# EAGLE design host-Insulation (EAGLE 6.6.0)
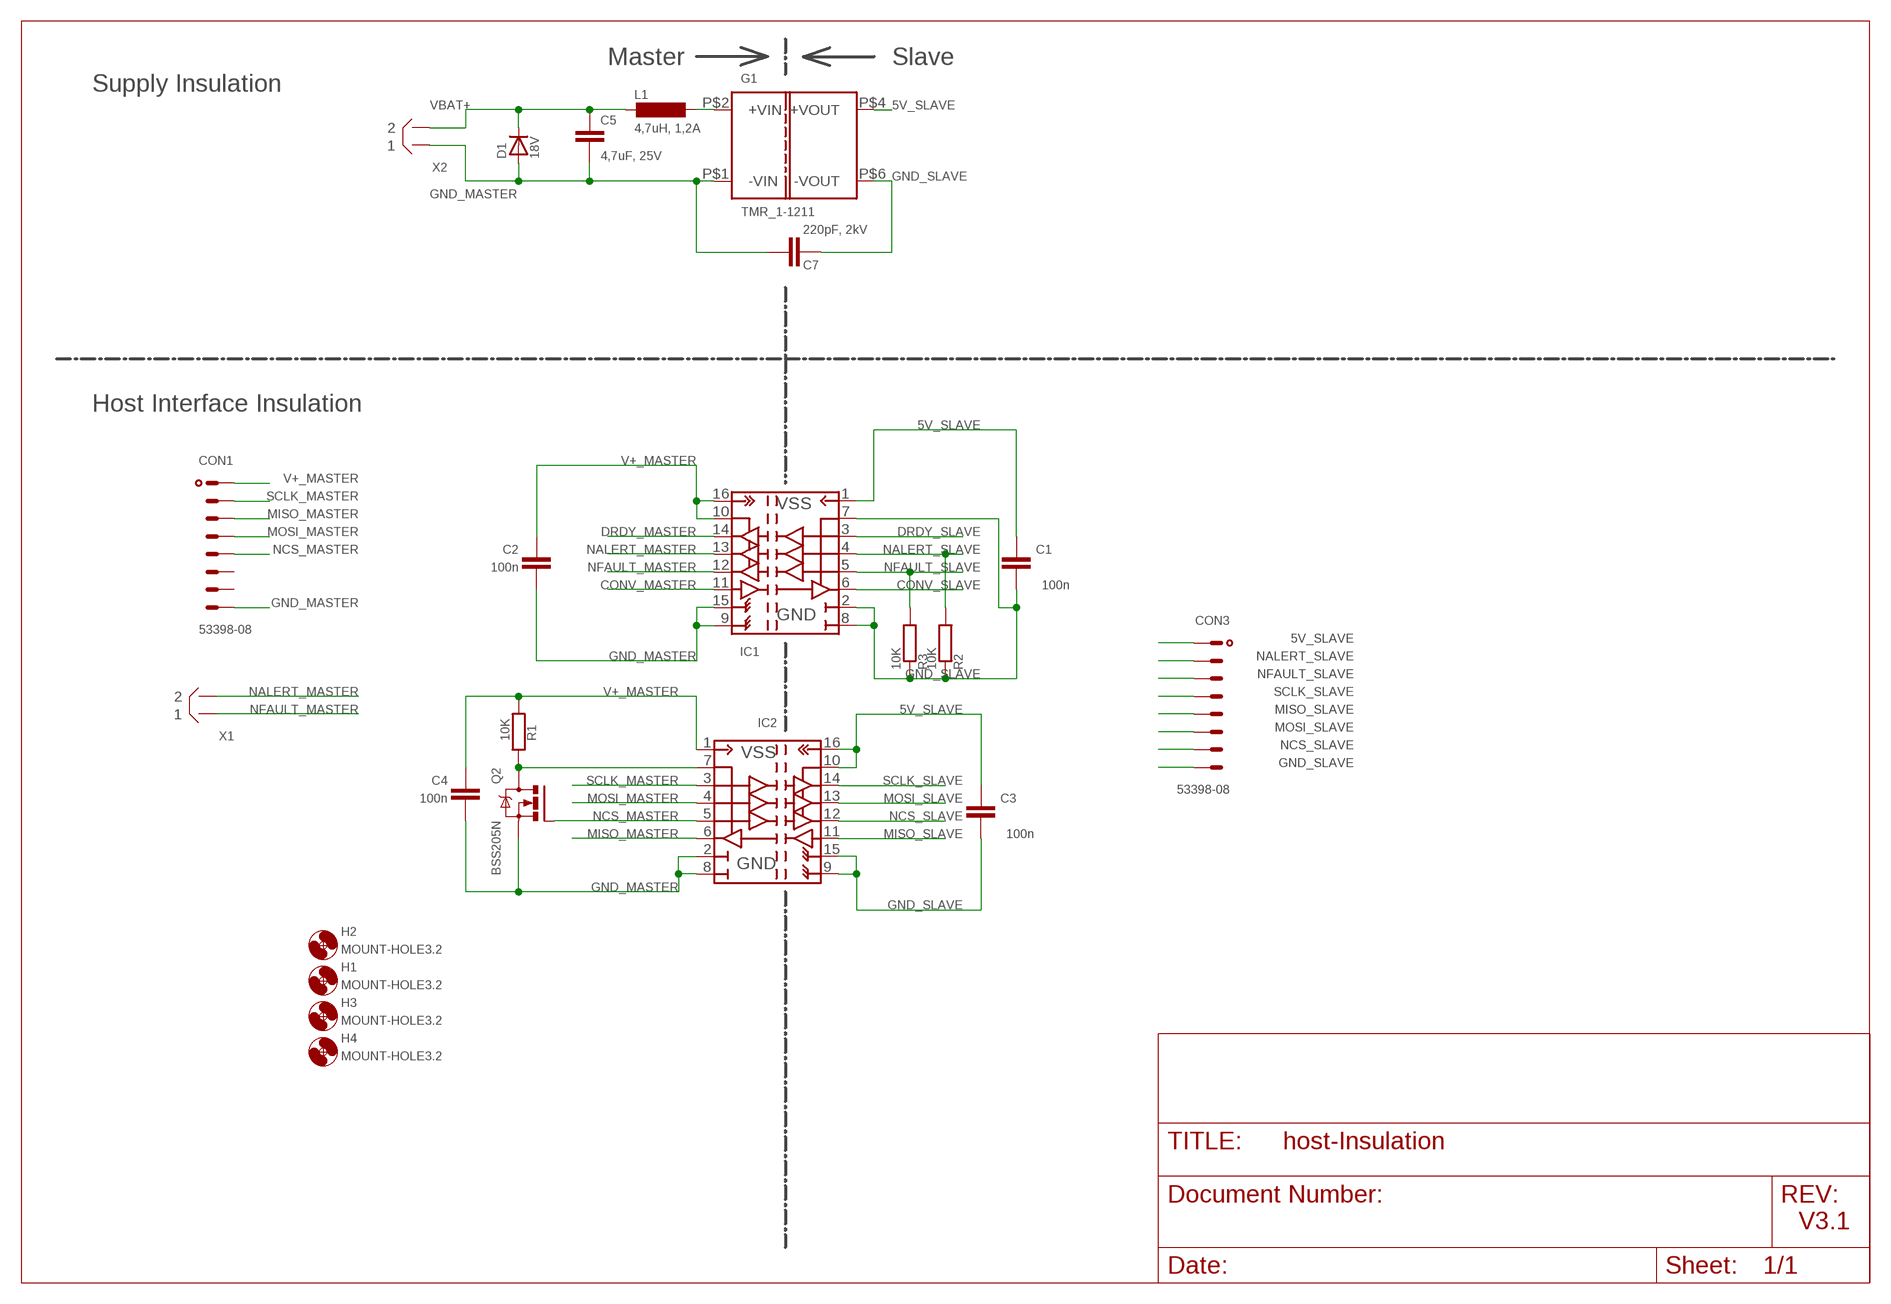
[diagram p0: schematic, sheet 1]

## Parts
C1  100n  CSTD  [C0805]
C2  100n  CSTD  [C0805]
C3  100n  CSTD  [C0805]
C4  100n  CSTD  [C0805]
C5  4,7uF, 25V  C-EUC0805  [C0805]
C7  220pF, 2kV  CC1210_HV  [C1210_HV]
CON1  53398-08  [53398-08]
CON3  53398-08  [53398-08]
D1  18V  DIODE-DO214AA  [DO214AA]
G1  TMR_1-1211  TMR_1-1  [TMR_1-??1?]
H1  MOUNT-HOLE3.2  [3,2]
H2  MOUNT-HOLE3.2  [3,2]
H3  MOUNT-HOLE3.2  [3,2]
H4  MOUNT-HOLE3.2  [3,2]
IC1  ISO7241  [R-PDSO-G16]
IC2  ISO7241  [R-PDSO-G16]
L1  4,7uH, 1,2A  L-EUL3225M  [L3225M]
Q2  BSS205N  [SOT23]
R1  10K  R  [R0805]
R2  10K  R  [R0805]
R3  10K  R  [R0805]
X1  B2B-XH  [B2B-XH]
X2  B2B-XH  [B2B-XH]

## Nets
5V_SLAVE: C1.2 C3.2 CON3.1 G1.P$4(+VOUT) IC1.1(VCC1) IC2.10(EN2) IC2.16(VCC2)
CONV_MASTER: IC1.11(IN_D)
CONV_SLAVE: IC1.6(OUT_D)
DRDY_MASTER: IC1.14(OUT_A)
DRDY_SLAVE: IC1.3(IN_A)
GND_MASTER: C2.1 C4.1 C5.2 C7.P$1 CON1.8 D1.A G1.P$1(-VIN) IC1.9(GND22) IC1.15(GND21) IC2.2(GND11) IC2.8(GND12) Q2.2(S) X2.P$1
GND_SLAVE: C1.1 C3.1 C7.P$2 CON3.8 G1.P$6(-VOUT) IC1.2(GND11) IC1.7(EN1) IC1.8(GND12) IC2.9(GND22) IC2.15(GND21) R2.1 R3.1
MISO_MASTER: CON1.3 IC2.6(OUT_D)
MISO_SLAVE: CON3.5 IC2.11(IN_D)
MOSI_MASTER: CON1.4 IC2.4(IN_B)
MOSI_SLAVE: CON3.6 IC2.13(OUT_B)
N$2: IC2.7(EN1) Q2.3(D) R1.1
N$5: G1.P$2(+VIN) L1.1
NALERT_MASTER: IC1.13(OUT_B) X1.P$2
NALERT_SLAVE: CON3.2 IC1.4(IN_B) R2.2
NCS_MASTER: CON1.5 IC2.5(IN_C) Q2.1(G)
NCS_SLAVE: CON3.7 IC2.12(OUT_C)
NFAULT_MASTER: IC1.12(OUT_C) X1.P$1
NFAULT_SLAVE: CON3.3 IC1.5(IN_C) R3.2
SCLK_MASTER: CON1.2 IC2.3(IN_A)
SCLK_SLAVE: CON3.4 IC2.14(OUT_A)
V+_MASTER: C2.2 C4.2 CON1.1 IC1.10(EN2) IC1.16(VCC2) IC2.1(VCC1) R1.2
VBAT+: C5.1 D1.C L1.2 X2.P$2
Unconnected: CON1.6 CON1.7

## Notes on the sheet
- Master | Slave
- Supply Insulation
- Host Interface Insulation
- V3.1

## Library data of the parts
C1-C4 C7 = useful:C
C5 = rcl:C-EU: CAPACITOR, European symbol
CON1 CON3 = con-molex:53?-08: CONNECTOR wire to board 1.25 mm (.049 inch) pitch header
D1 = diode:DIODE-: DIODE
G1 = traco-power:TMR_1-??1?
H1-H4 = holes:MOUNT-HOLE: MOUNTING HOLE with drill center marker
IC1 IC2 = ti:ISO7241
L1 = rcl:L-EU: INDUCTOR, European symbol
Q2 = infineon:BSS205N: Infineon Small Signal Transistor, OptiMOS 2 Technology, 20V, 2.5A SOT23
R1-R3 = useful:R
X1 X2 = con-jst-xh:?2B-XH

## Board
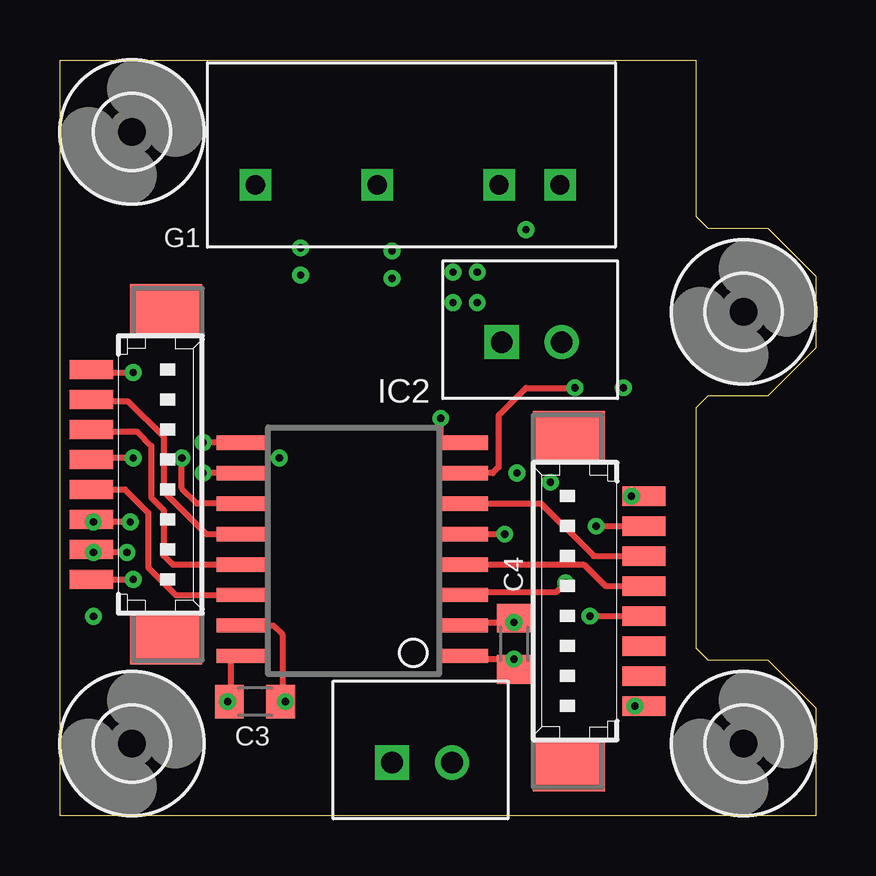
[diagram p1: board, top side]
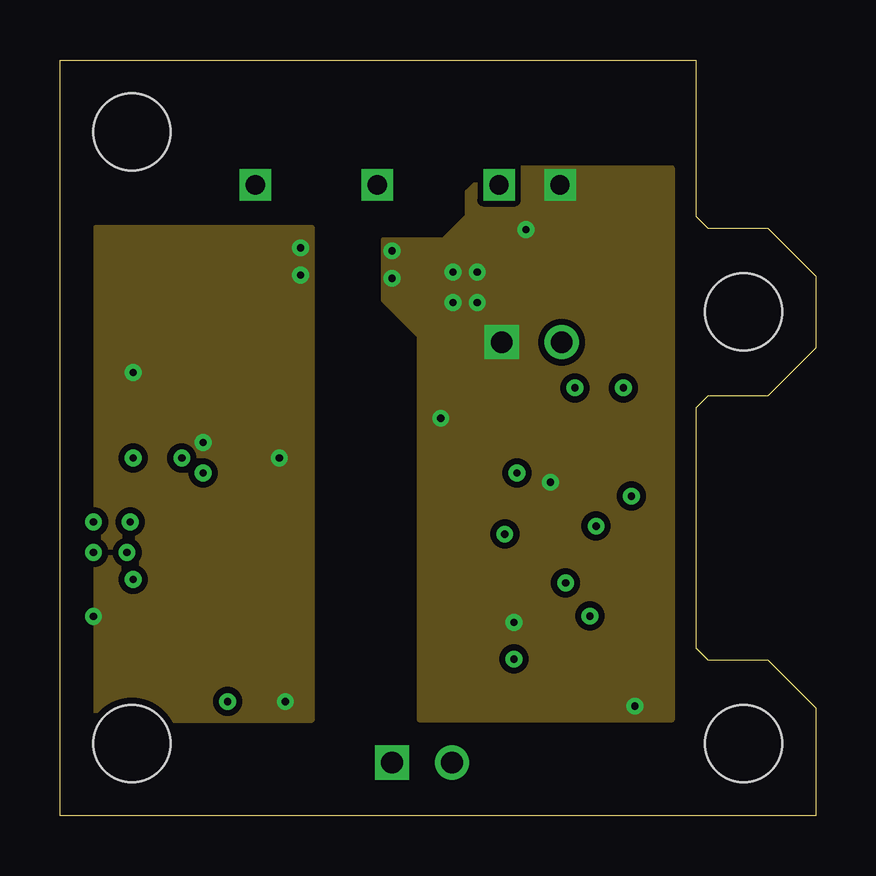
[diagram p2: board, inner layer Route2]
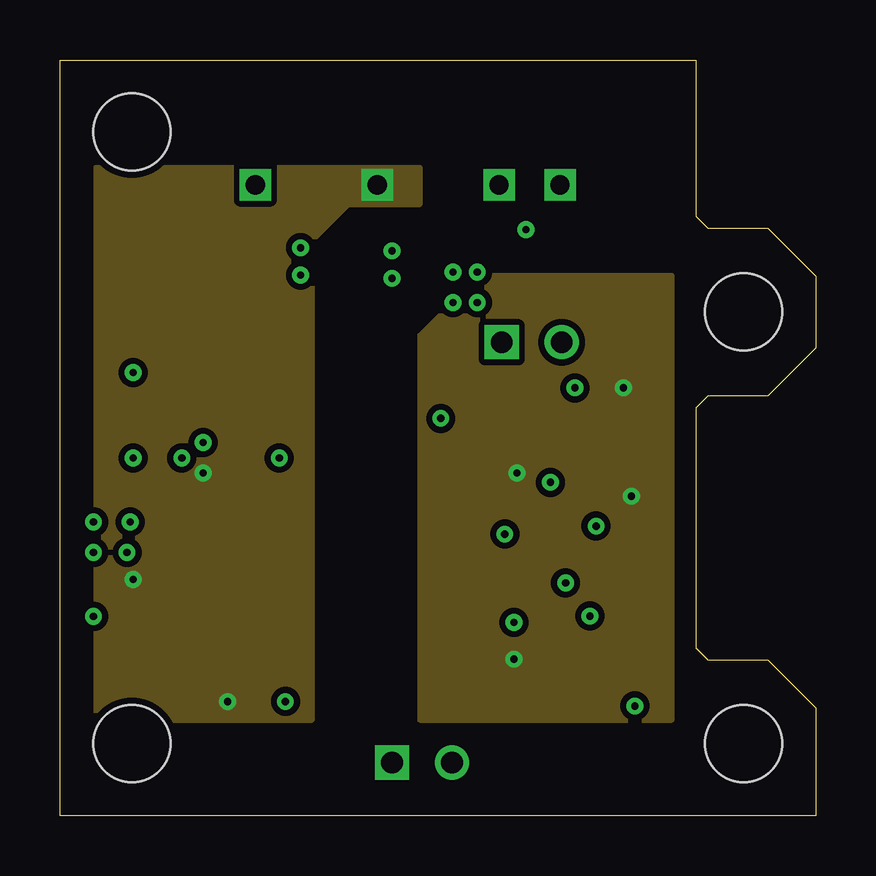
[diagram p3: board, inner layer Route15]
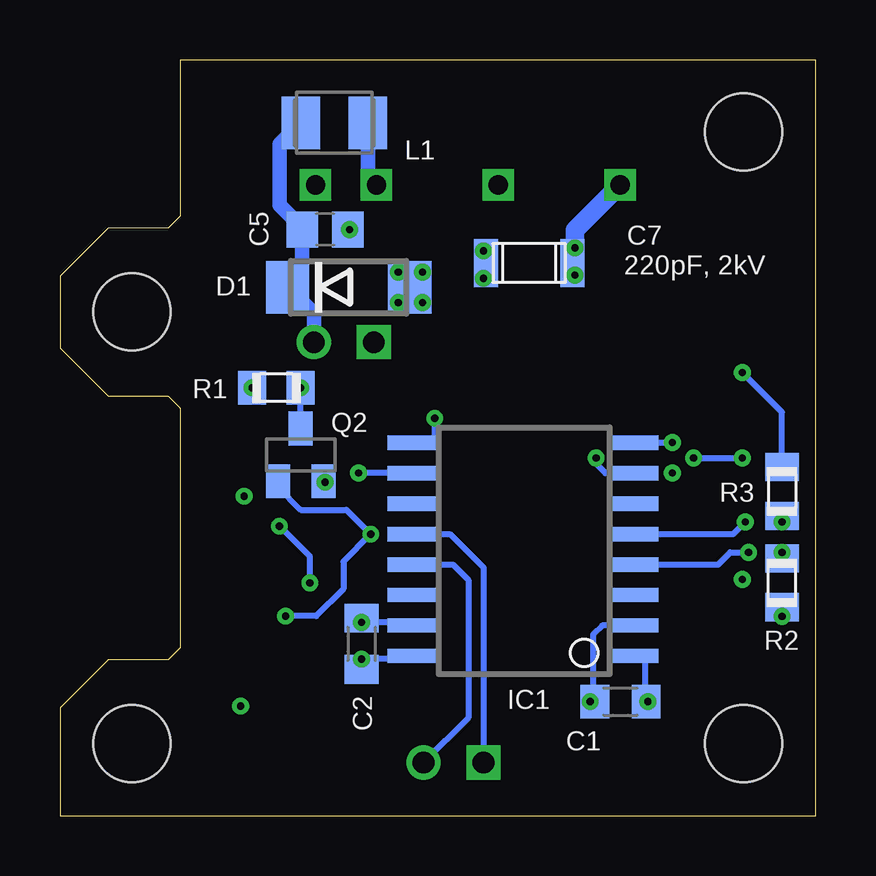
[diagram p4: board, bottom side, seen from below]

Size 31.5 x 31.5 mm. Coordinates in mm from the lower left corner, seen from the top.
Outline: 0,31.5 26.5,31.5 26.5,25 27,24.5 29.5,24.5 31.5,22.5 31.5,19.5 29.5,17.5 27,17.5 26.5,17 26.5,7 27,6.5 29.5,6.5 31.5,4.5 31.5,0 0,0 0,31.5
Copper layers (1+2*15+16): Top 0.035mm / dielectric 0.2mm / Route2 0.035mm / dielectric 0.5mm / Route15 0.035mm / dielectric 0.2mm / Bottom 0.035mm
Design rules "ats_35u_4layer_2 *": minimum track width 10mil, minimum drill 0.2mm, track to track 10mil, track to pad 10mil, pad to pad 10mil, via to via 10mil, smd to smd 10mil, copper to edge 0.3mm, drill to drill 8mil, minimum pad ring 10mil, minimum via ring 0.2mm, stop-mask expansion 4mil, vias tented up to drill 0mil, thermal gap 10mil

### Footprints (pad centres in the part's own frame; a part is rotated, then mirrored left to right if it is on the bottom)
C0805 = smd 1.2 x 1.4: 1 -1.066,0; 2 1.066,0
C0805' = smd 1.3 x 1.5: 1 -0.95,0; 2 0.95,0
C1210_HV = smd 1 x 2: P$1 -1.8,0; P$2 1.8,0
53398-08 = smd 0.8 x 1.8: 1 4.375,-2.5; 2 3.125,-2.5; 3 1.875,-2.5; 4 0.625,-2.5; 5 -0.625,-2.5; 6 -1.875,-2.5; 7 -3.125,-2.5; 8 -4.375,-2.5 | smd 2.1 x 3: S1 6.875,0.625; S2 -6.875,0.625
DO214AA = smd 1.8 x 2.2: A 2.55,0; C -2.55,0
TMR_1-??1? = drill 0.8 square: P$1 0,0; P$2 2.54,0; P$4 7.62,0; P$6 12.7,0
3,2 = hole 3.2: 0,0
R-PDSO-G16 = smd 0.6 x 2: 1 -3.937,-4.649; 2 -2.667,-4.649; 3 -1.397,-4.649; 4 -0.127,-4.649; 5 1.143,-4.649; 6 2.413,-4.649; 7 3.683,-4.649; 8 4.953,-4.649; 9 4.953,4.651; 10 3.683,4.651; 11 2.413,4.651; 12 1.143,4.651; 13 -0.127,4.651; 14 -1.397,4.651; 15 -2.667,4.651; 16 -3.937,4.651
L3225M = smd 1.6 x 2.2: 1 -1.4,0; 2 1.4,0
SOT23 = smd 1 x 1.4: 1 -0.95,-1.1; 2 0.95,-1.1; 3 0,1.1
R0805 = smd 1.168 x 1.397: 1 -1.016,0; 2 1.016,0
B2B-XH = drill 0.9 pad 1.422 square: P$1 0,0 | drill 0.9 pad 1.422: P$2 2.5,0

### Placement (x,y rotation side)
C1  8.13,4.75 0 bottom
C2  18.93,7.16 270 bottom
C3  8.13,4.75 180 top
C4  18.93,7.16 270 top
C5  4,7uF, 25V  [C0805']  20.45,24.43 0 bottom
C7  11.94,23.04 0 bottom
CON1  21.84,8.94 90 top
CON3  3.81,14.22 270 top
D1  19.47,22.02 0 bottom
G1  20.85,26.29 180 top
H1  28.5,3 0 top
H2  28.5,21 0 top
H3  3,3 0 top
H4  3,28.5 0 top
IC1  12.19,10.59 90 bottom
IC2  12.19,10.59 90 top
L1  20.07,28.88 180 bottom
Q2  21.46,15.03 0 bottom
R1  22.48,17.83 180 bottom
R2  1.4,9.7 90 bottom
R3  1.4,13.51 270 bottom
X1  13.84,2.21 0 top
X2  18.41,19.73 0 top

### Tracks (layer width: path | path; a pad name or v marks a point on that pad's centre or on a via)
5V_SLAVE  (via drill 0.3)
  Top 0.254: v6.99,4.75 C3.2 7.06,4.83 7.11,4.88 7.11,6.66 IC1.1 | IC2.10 v5.97,14.28 | CON3.1 v3.05,9.85
  Bottom 0.254: IC1.1 7.11,6.66 7.11,4.75 C3.2 v6.99,4.75
  pour Route15 (no thermals): 15,27 1.5,27 1.5,4 10.5,4 10.5,24 12,25.5 15,25.5
GND_MASTER  (via drill 0.3)
  Top 0.254: IC2.8 15.88,15.55 v15.88,16.56 | CON1.8 v23.96,4.56 | v18.92,8.05 18.54,8.05 | IC2.2 16.96,8.05 v18.92,8.05 | v18.92,8.05 v18.93,8.05 | C4.1 19,8.18 v18.92,8.05
  Bottom 0.254: IC2.8 15.88,15.55 v15.88,16.56 | Q2.2 20.47,13.89 v20.45,13.89 | v13.84,22.4 13.74,22.5 C7.P$1 13.74,23.44 v13.84,23.54 | IC2.2 16.97,8.05 v18.92,8.05 C4.1 | D1.A 16.92,21.79 v16.38,21.38 | C5.2 v19.43,24.43
  other vias: 16.38,22.65 17.4,22.65 17.4,21.38
  pour Route2 (no thermals): 15,4 15,20 13.5,21.5 13.5,24 16,24 17,25 17,26 18,27 25.5,27 25.5,4
GND_SLAVE  (via drill 0.3)
  Top 0.254: v9.4,4.75 C1.1 9.27,4.83 9.27,7.54 8.89,7.93 IC1.2 | IC1.8 v5.97,15.55 | v3.05,18.47 1.65,18.47 1.61,18.5 1.61,18.52 CON3.8
  Bottom 0.254: IC1.2 8.89,7.93 9.27,7.54 9.27,4.83 C1.1 v9.4,4.75 | IC1.8 v5.97,15.55 | R3.1 1.4,16.82 v3.05,18.47 | R2.1 v1.4,8.31 | IC1.7 8.76,14.28 9.14,14.66 v9.14,14.91
  Bottom 0.508: C7.P$2 10.14,22.64 v10.03,22.53
  Bottom 0.762: v10.03,23.67 10.03,24.41 G1.P$6
  pour Route2 (no thermals): 10.5,24.5 1.5,24.5 1.5,4 10.5,4
MISO_MASTER
  Top 0.254: IC2.6 20.06,13.01 22.25,10.81 CON1.3
MISO_SLAVE  (via drill 0.3)
  Top 0.254: v3.05,14.91 1.52,14.91 1.52,14.78 1.31,14.78 CON3.5 | IC2.11 5.71,13.01 5.08,13.64 v5.08,14.91
  Bottom 0.254: v5.08,14.91 v3.05,14.91
MOSI_MASTER
  Top 0.254: IC2.4 21.84,10.47 22.74,9.56 CON1.4
MOSI_SLAVE
  Top 0.254: CON3.6 1.31,16 3.22,16 3.81,15.41 3.81,13.26 4.32,12.75 4.32,10.84 4.7,10.46 IC2.13
N$2  (via drill 0.3)
  Top 0.254: IC2.7 18.03,14.28 18.29,14.53 18.29,16.68 19.43,17.83 R1.1
  Bottom 0.254: Q2.3 R1.1
  other vias: 21.46,17.83
N$5
  Bottom 0.61: L1.1 18.67,26.65 G1.P$2
NALERT_MASTER
  Bottom 0.254: IC1.13 15.12,10.47 14.48,9.83 14.48,4.08 X1.P$2
NALERT_SLAVE  (via drill 0.3)
  Top 0.254: v2.79,10.97 v1.4,10.97 1.4,11.02 CON3.2
  Bottom 0.254: v1.4,10.97 R2.2 | IC1.4 4.06,10.47 3.56,10.97 v2.8,10.97 v2.79,10.97
NCS_MASTER  (via drill 0.3)
  Top 0.254: v22.1,8.31 CON1.5 | IC2.5 v18.54,11.74 v18.54,11.73
  Bottom 0.254: v22.1,8.31 20.82,8.31 19.68,9.45 19.68,10.59 v18.54,11.73 19.56,12.75 21.46,12.75 22.41,13.69 Q2.1
NCS_SLAVE
  Top 0.254: CON3.7 1.31,17.25 2.86,17.25 4.32,15.8 4.32,13.51 6.1,11.73 IC2.12
NFAULT_MASTER
  Bottom 0.254: IC1.12 15.24,11.74 13.84,10.34 X1.P$1
NFAULT_SLAVE  (via drill 0.3)
  Top 0.254: v2.92,12.24 v1.4,12.24 1.31,12.24 CON3.3
  Bottom 0.254: v1.4,12.24 R3.2 | IC1.5 3.43,11.74 v2.92,12.24
SCLK_MASTER  (via drill 0.3)
  Top 0.254: v22.35,12.06 CON1.2 | IC2.3 17.53,9.2 17.65,9.32 20.7,9.32 v21.08,9.7
  Bottom 0.254: v21.08,9.7 21.08,10.79 v22.35,12.06
SCLK_SLAVE
  Top 0.254: CON3.4 2.71,13.6 3.68,12.62 3.68,10.34 4.83,9.19 IC2.14
V+_MASTER  (via drill 0.3)
  Top 0.254: CON1.1 v23.82,13.31 | IC2.1 16.97,6.53 v18.92,6.53 19,6.53 C4.2
  Bottom 0.254: IC1.10 v19.05,14.28 | IC2.1 16.97,6.53 v18.92,6.53 C4.2
  other vias: 23.5,17.83
  pour Route15 (no thermals): 15,4 25.5,4 25.5,22.5 17.5,22.5 15,20
VBAT+
  Bottom 0.61: X2.P$2 20.91,20.92 D1.C 21.4,22.64 C5.1 21.4,24.49 22.35,25.45 22.35,27.99 L1.2

### Text on the board
tTest: V3.1 | GND | 12VDC | Fault | Alert
bTest: TERA TU Graz, Pöschl | V3.1 | BMS Host / Insulation